# EasyEDA schematic SCH_PID LINE FOLLOWER_2023-06-07.json
TITLE: PID Line follower; REV: 1.5; Date: 2023-06-06; Sheet: 1/1; Drawn By: Dhruva Shaw; Company: Dhruva Shaw
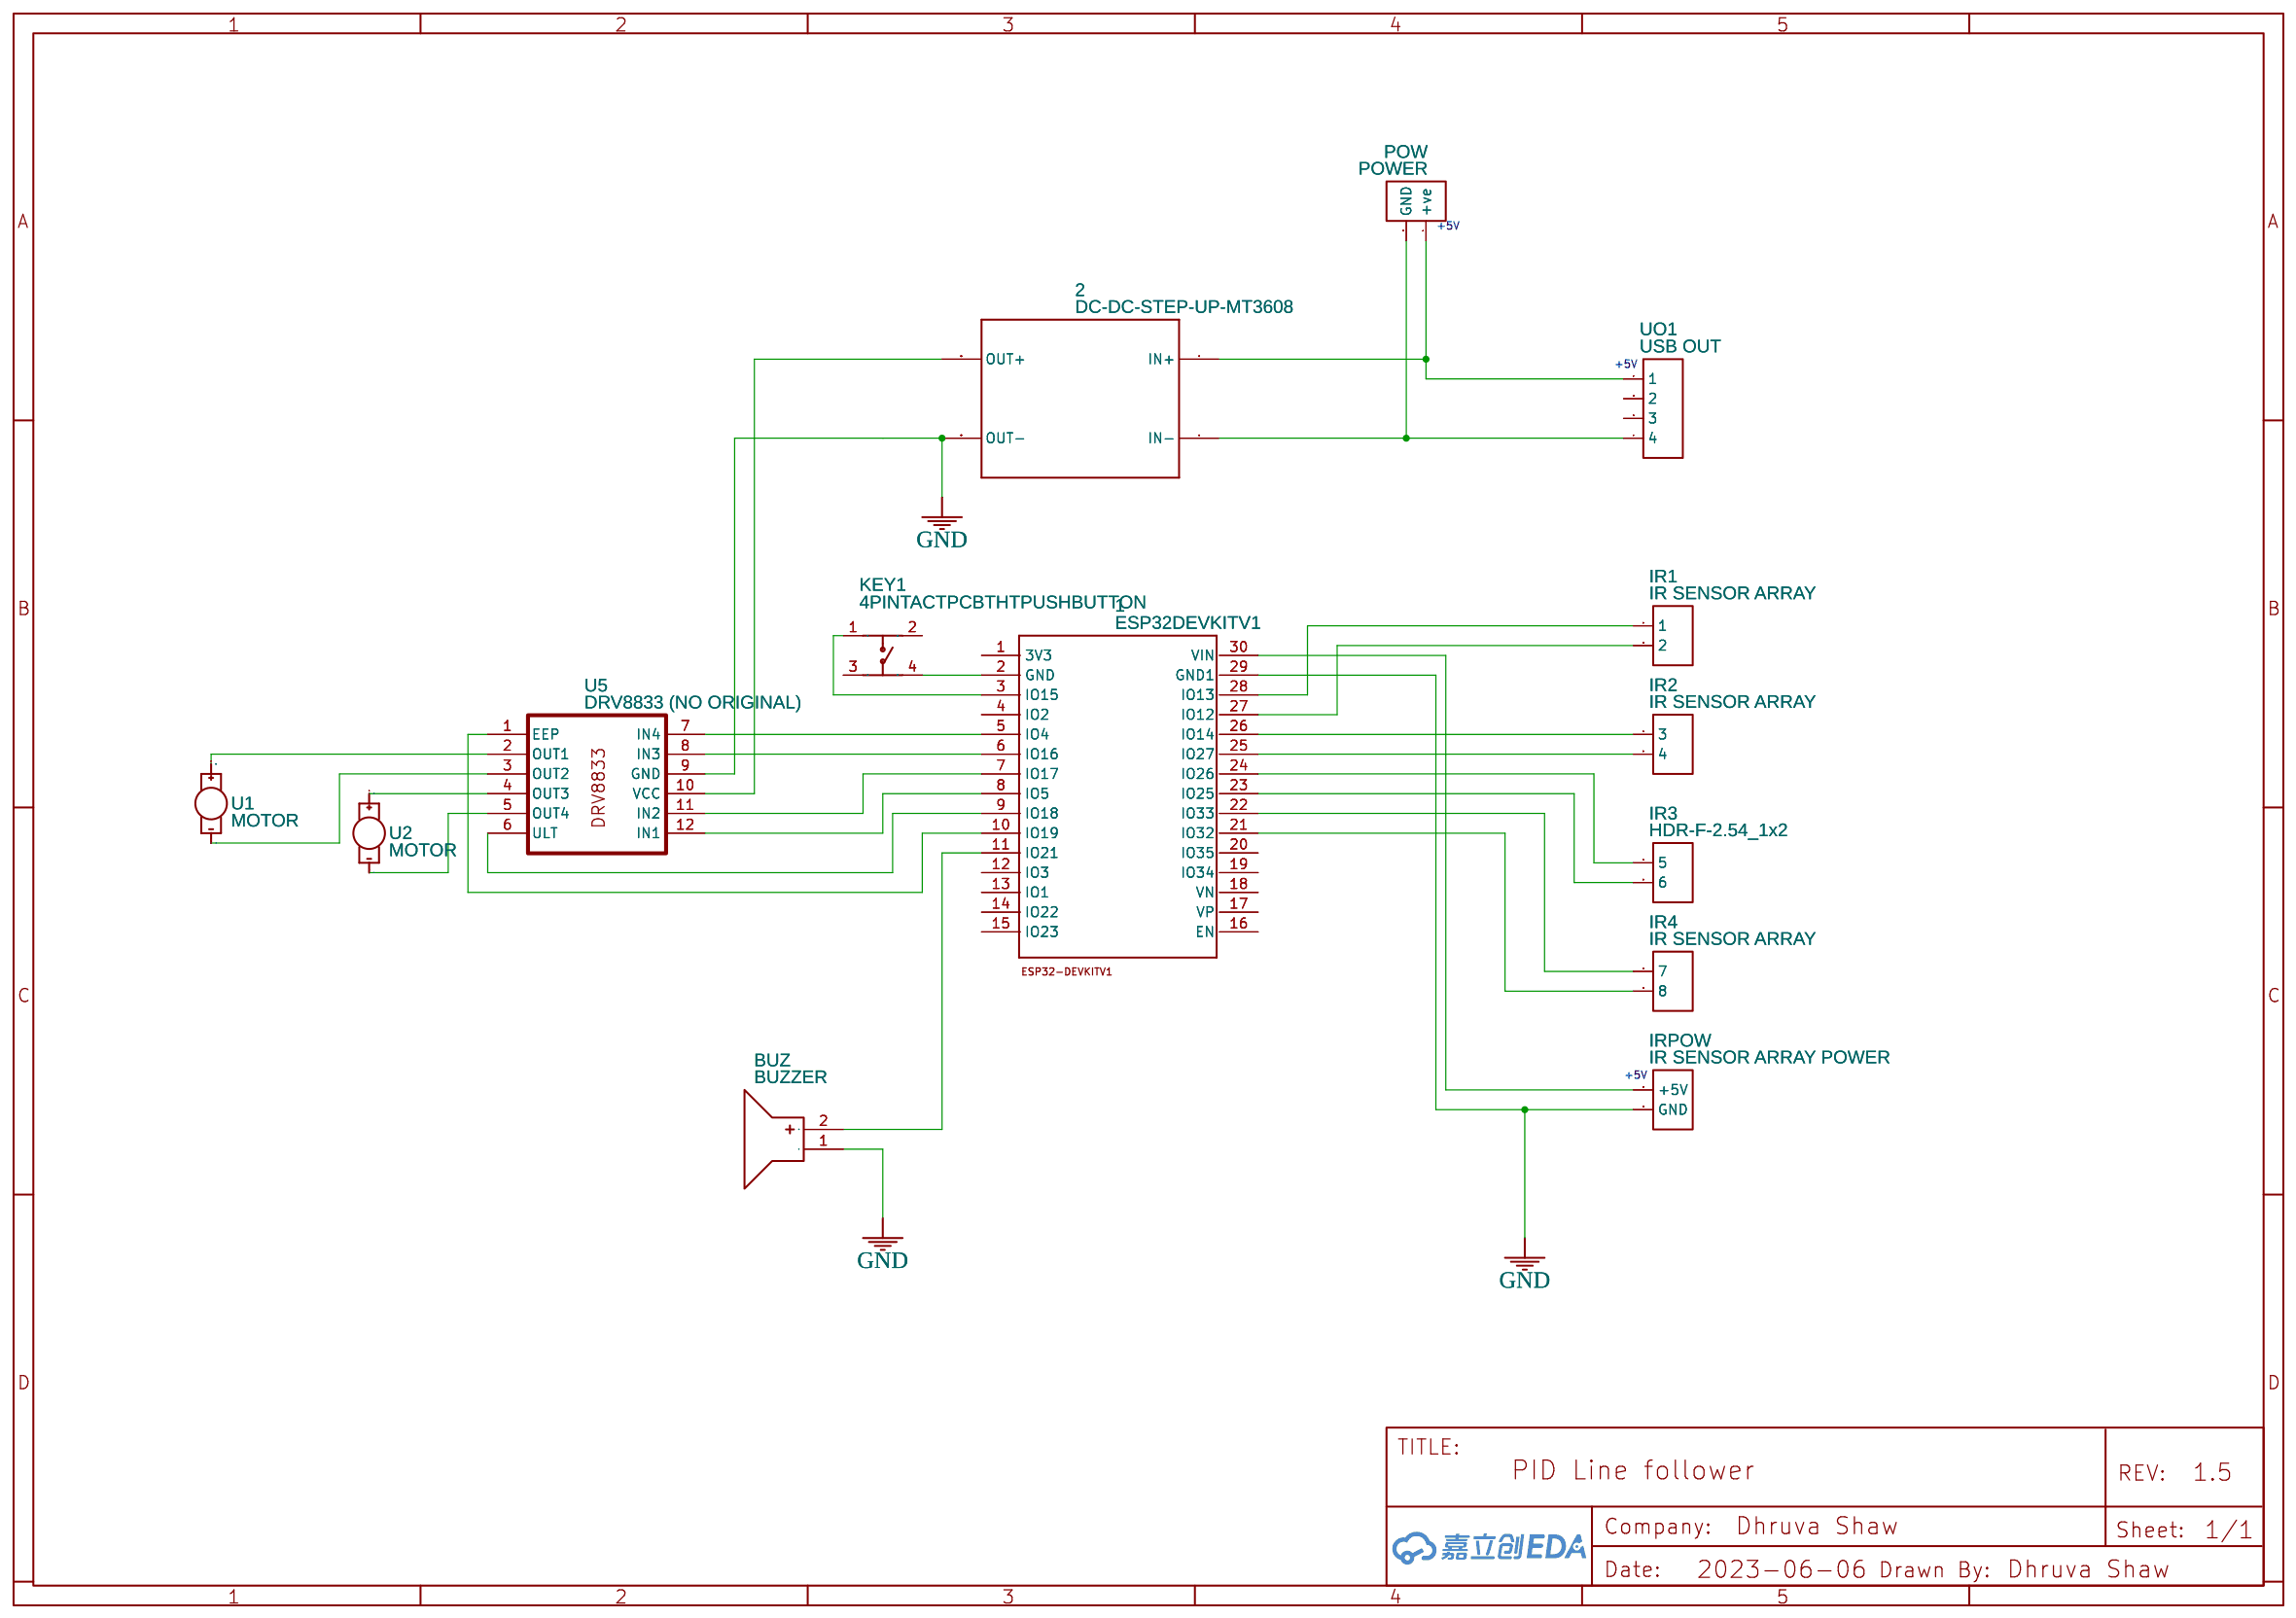
[diagram p0: schematic sheet]

## Parts
1  ESP32DEVKITV1  [ESP32-DEVKITV1]
2  DC-DC-STEP-UP-MT3608  [DC-DC-STEP-UP-MT3608]
BUZ  BUZZER  [BUZ-TH_BD12.0-P6.00-D0.9-RD]
IR1  IR SENSOR ARRAY  [HDR-F-2.54_1X2]
IR2  IR SENSOR ARRAY  [HDR-F-2.54_1X2]
IR3  HDR-F-2.54_1x2  [HDR-F-2.54_1X2]
IR4  IR SENSOR ARRAY  [HDR-F-2.54_1X2]
IRPOW  IR SENSOR ARRAY POWER  [HDR-F-2.54_1X2]
KEY1  4PINTACTPCBTHTPUSHBUTTON  [SW-SMD_4P-L6.0-W6.0-P4.50-LS10.0_TL3301EF160QG]
POW  POWER  [HDR-F-2.54_1X2]
U1  MOTOR  [VIBE-MOTOR-10MM]
U2  MOTOR  [VIBE-MOTOR-10MM]
U5  DRV8833 (NO ORIGINAL)  [DRV8833 (NO ORIGINAL)]
UO1  USB OUT  [HDR-F-2.54_1X4]

## Library data of the parts
1 = ESP32DEVKITV1: Contributor: Валентин Печенко; Supplier: Digi-Key
2 = DC-DC-STEP-UP-MT3608: Contributor: arenda1234
BUZ = BUZZER: Supplier: LCSC; Supplier Part: C9900014030; Manufacturer: null; Manufacturer Part: buzzer; JLCPCB Part Class: Extended Part; Contributor: lcsc
IR1-IR4 IRPOW POW = HDR-F-2.54_1x2: Supplier Part: C49661; Supplier: LCSC; Contributor: LCEDA_Lib
KEY1 = 4PINTACTPCBTHTPUSHBUTTON: Supplier: LCSC; Supplier Part: C9900003768; Manufacturer: null; Manufacturer Part: 4pinTACTPCBTHTPushButton; Contributor: LCSC; JLCPCB Part Class: Extended Part
U1 U2 = MOTOR: Contributor: Tuấn Phạm
U5 = DRV8833 (NO ORIGINAL): Contributor: PiterSantaCruz
UO1 = HDR-F-2.54_1x4: Supplier Part: C225501; Supplier: LCSC; Contributor: LCEDA_Lib

## Nets
GND: 1.29(GND1) 2.OUT- BUZ.1(-) IRPOW.2(GND) U5.9(GND)
Net-(1-2): 1.2(GND) KEY1.4
Net-(1-3): 1.3(IO15) KEY1.1
Net-(1-5): 1.5(IO4) U5.7(IN4)
Net-(1-6): 1.6(IO16) U5.8(IN3)
Net-(1-7): 1.7(IO17) U5.11(IN2)
Net-(1-8): 1.8(IO5) U5.12(IN1)
Net-(1-9): 1.9(IO18) U5.6(ULT)
Net-(1-10): 1.10(IO19) U5.1(EEP)
Net-(1-11): 1.11(IO21) BUZ.2(+)
Net-(1-21): 1.21(IO32) IR4.2(8)
Net-(1-22): 1.22(IO33) IR4.1(7)
Net-(1-23): 1.23(IO25) IR3.2(6)
Net-(1-24): 1.24(IO26) IR3.1(5)
Net-(1-25): 1.25(IO27) IR2.2(4)
Net-(1-26): 1.26(IO14) IR2.1(3)
Net-(1-27): 1.27(IO12) IR1.2
Net-(1-28): 1.28(IO13) IR1.1
Net-(1-30): 1.30(VIN) IRPOW.1(+5V)
Net-(2-IN+): 2.IN+ POW.1(+ve) UO1.1
Net-(2-IN-): 2.IN- POW.2(GND) UO1.4
Net-(2-OUT+): 2.OUT+ U5.10(VCC)
Net-(U1-+): U1.+ U5.2(OUT1)
Net-(U1--): U1.- U5.3(OUT2)
Net-(U2-+): U2.+ U5.4(OUT3)
Net-(U2--): U2.- U5.5(OUT4)

Not connected (* = marked no-connect by the designer): 1 1(3V3) 4(IO2) 12(IO3) 13(IO1) 14(IO22) 15(IO23) 16(EN) 17(VP) 18(VN) 19(IO34) 20(IO35); KEY1 2 3; UO1 2 3

## Notes on the sheet
- +5V
- +5V
- +5V
